# EAGLE design proyek kelompok 10 (EAGLE 7.2.0)
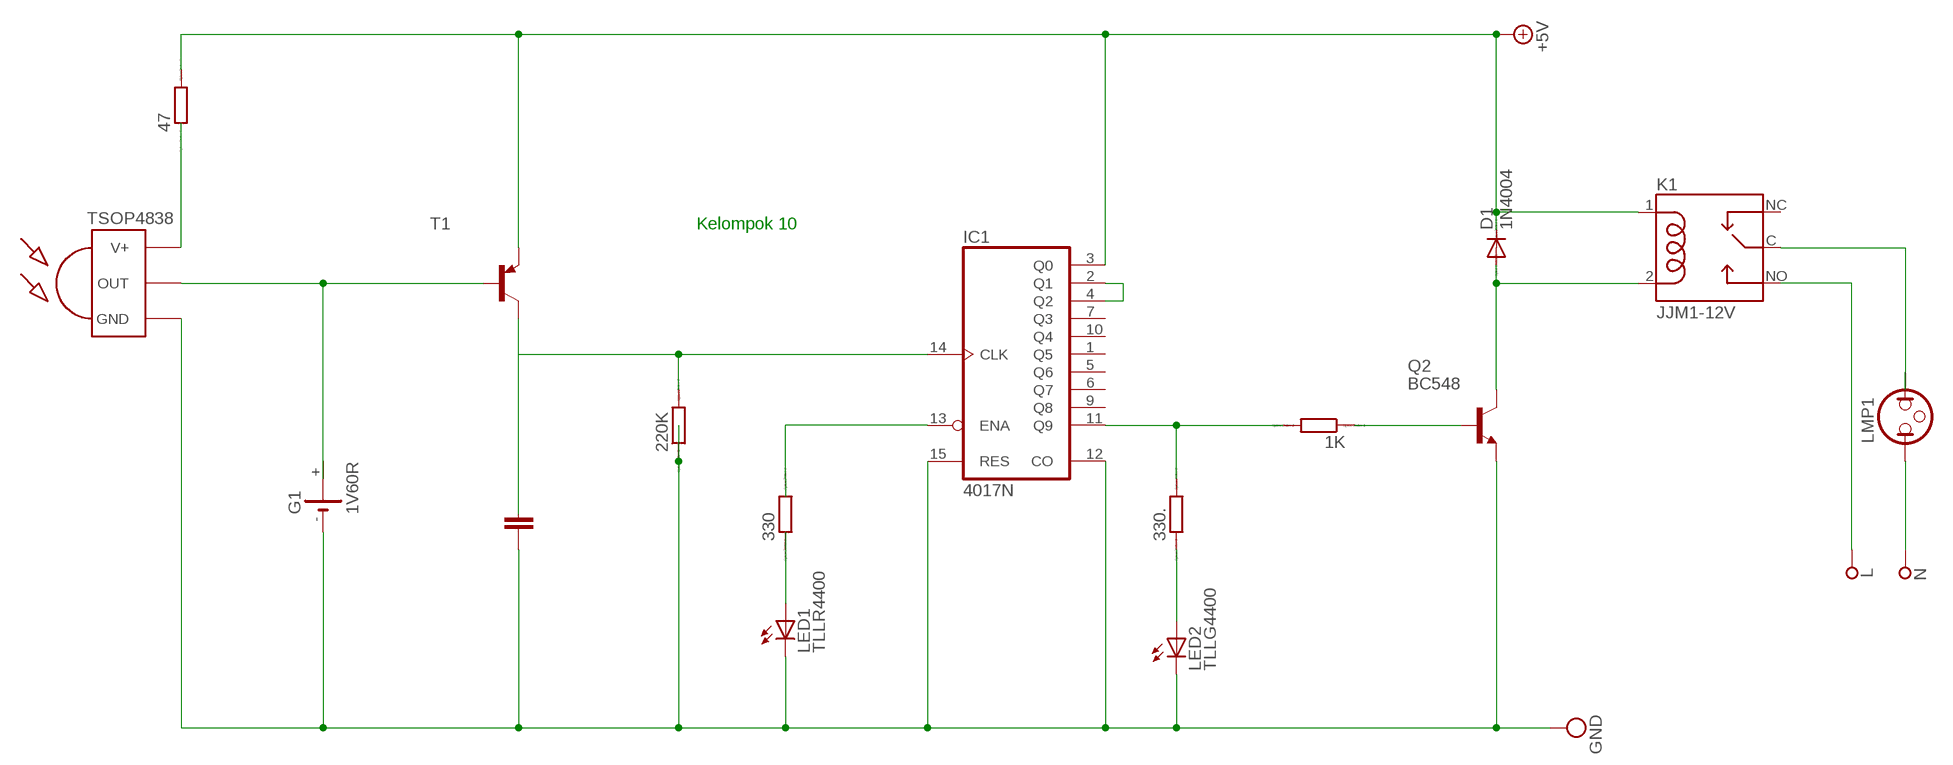
[diagram p0: schematic, sheet 1]

## Parts
1K  R0207/10  [0207/10]
47  R0207/10  [0207/10]
220K  R0207/10  [0207/10]
330  R0207/10  [0207/10]
330.  R0207/10  [0207/10]
D1  1N4004  [DO41-10]
G1  1V60R  [1V60R]
IC1  4017N  [DIL16]
K1  JJM1-12V  [RELAY_JJM1-12V]
L  SPECIAL_DRILL_0.1000  [PAD_0.1000]
LED1  TLLR4400  [LED3MM]
LED2  TLLG4400  [LED3MM]
LMP1  NEON  [LDH-3R]
N  SPECIAL_DRILL_0.1000  [PAD_0.1000]
Q2  BC548  [TO92-EBC]
T1  BC558A-PNP-TO92-EBC  [TO92-EBC]
U$1  TSOP4838  [TSOP18XX]

## Nets
47: 47.1 U$1.VCC(V+)
+5V: 47.2 D1.C IC1.3(Q0) K1.1(C1) T1.E
N$2: G1.+@1(+) T1.B U$1.OUT
N$3: 220K.2 IC1.14(CLK)
N$4: T1.C
N$5: K1.C(M) LMP1.2
N$6: 330.1 LED1.A
N$7: 1K.2 330..2 IC1.11(Q9)
N$8: 330.2 IC1.13(ENA)
N$9: D1.A K1.2(C2) Q2.C
N$11: LMP1.1 N.1
N$12: K1.NO L.1
N$14: IC1.2(Q1) IC1.4(Q2)
N$16: 1K.1 Q2.B
N$17: 330..1 LED2.A
VDD: 220K.1 G1.- IC1.12(CO) IC1.15(RES) LED1.K(C) LED2.K(C) Q2.E U$1.GND ; supply symbol labelled GND
Unconnected: G1.+ IC1.1(Q5) IC1.5(Q6) IC1.6(Q7) IC1.7(Q3) IC1.9(Q8) IC1.10(Q4) K1.NC

## Notes on the sheet
- Kelompok 10

## Power pins joined to a net without a drawn wire
VDD: IC1.16(VDD)
VSS: IC1.8(VSS)

## Library data of the parts
1K 47 220K 330 330. = eagle-ltspice:R: RESISTOR, European symbol; SPICEMODEL: NONE; SPICEPREFIX: R
D1 = diode:1N4004: DIODE general purpose rectifier, 1 A
G1 = battery:1V60R: NC ACCU Varta
IC1 = 40xx:4017: COUNTER/DIVIDER
K1 = JJM1-12V:JJM1-12V: Electromechanical Relay 12VDC 225Ohm 20(NO)/10(NC)A SPDT (( 15.5mm 12mm 13.9mm)) THT Automotive Relay Check availability <https://pricing.snapeda.com/parts/JJM1-12V/Panasonic%20Electric%20Works/view-part?ref=eda>; AVAILABILITY: In Stock; DESCRIPTION: RELAY AUTOMOTIVE SPDT 20A 12V; MF: Panasonic Electric Works; MP: JJM1-12V; PACKAGE: None; PRICE: None; PURCHASE-URL: https://pricing.snapeda.com/search/part/JJM1-12V/?ref=eda
L N = special-drill:SPECIAL_DRILL_: Special drills
LED1 = led:TLLR4400: Low Current (2mA) LED 3 mm Tinted Diffused Package color RED Source: Data sheet <http://www.farnell.com/datasheets/391100.pdf>; MF: VISHAY SEMICONDUCTOR; OC_FARNELL: 1612437
LED2 = led:TLLG4400: Low Current (2mA) LED 3 mm Tinted Diffused Package color GREEN Source: Data sheet <http://www.farnell.com/datasheets/391098.pdf>; MF: VISHAY SEMICONDUCTOR; OC_FARNELL: 1612435
LMP1 = special:NEON: Neon LAMP
Q2 = transistor-npn:BC548*: NPN Transistor
T1 = transistor:*-PNP-: PNP Transistror
U$1 = tsop-1:TSOP4838: IR Receiver and Demodulator

## Board
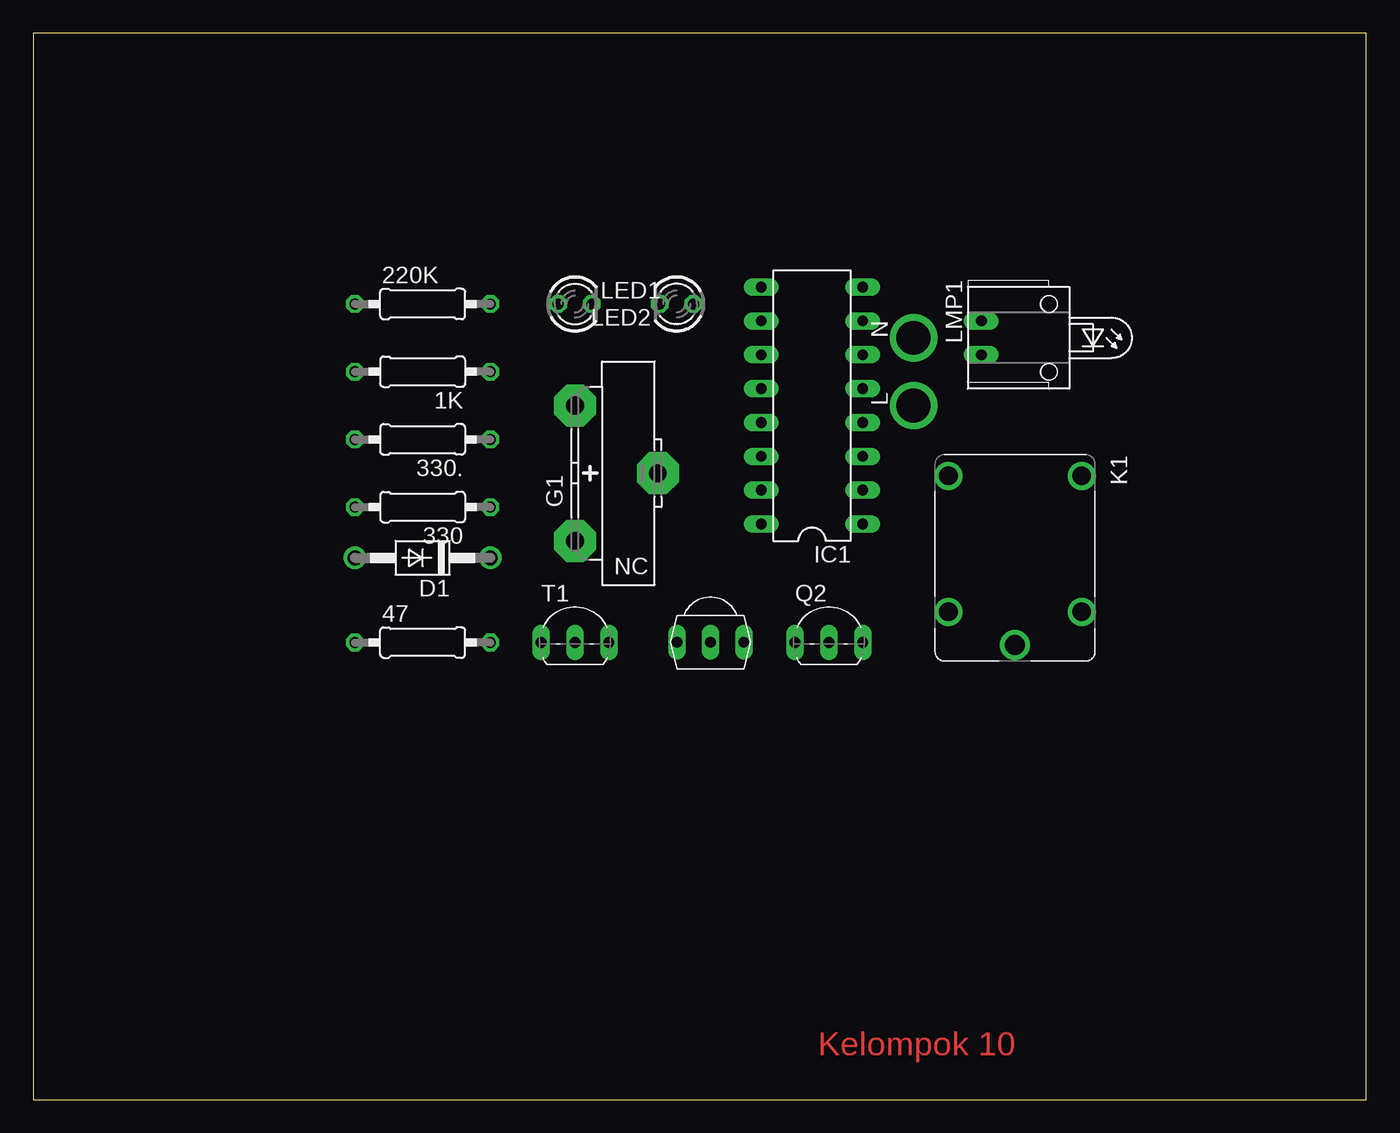
[diagram p1: board, top side]
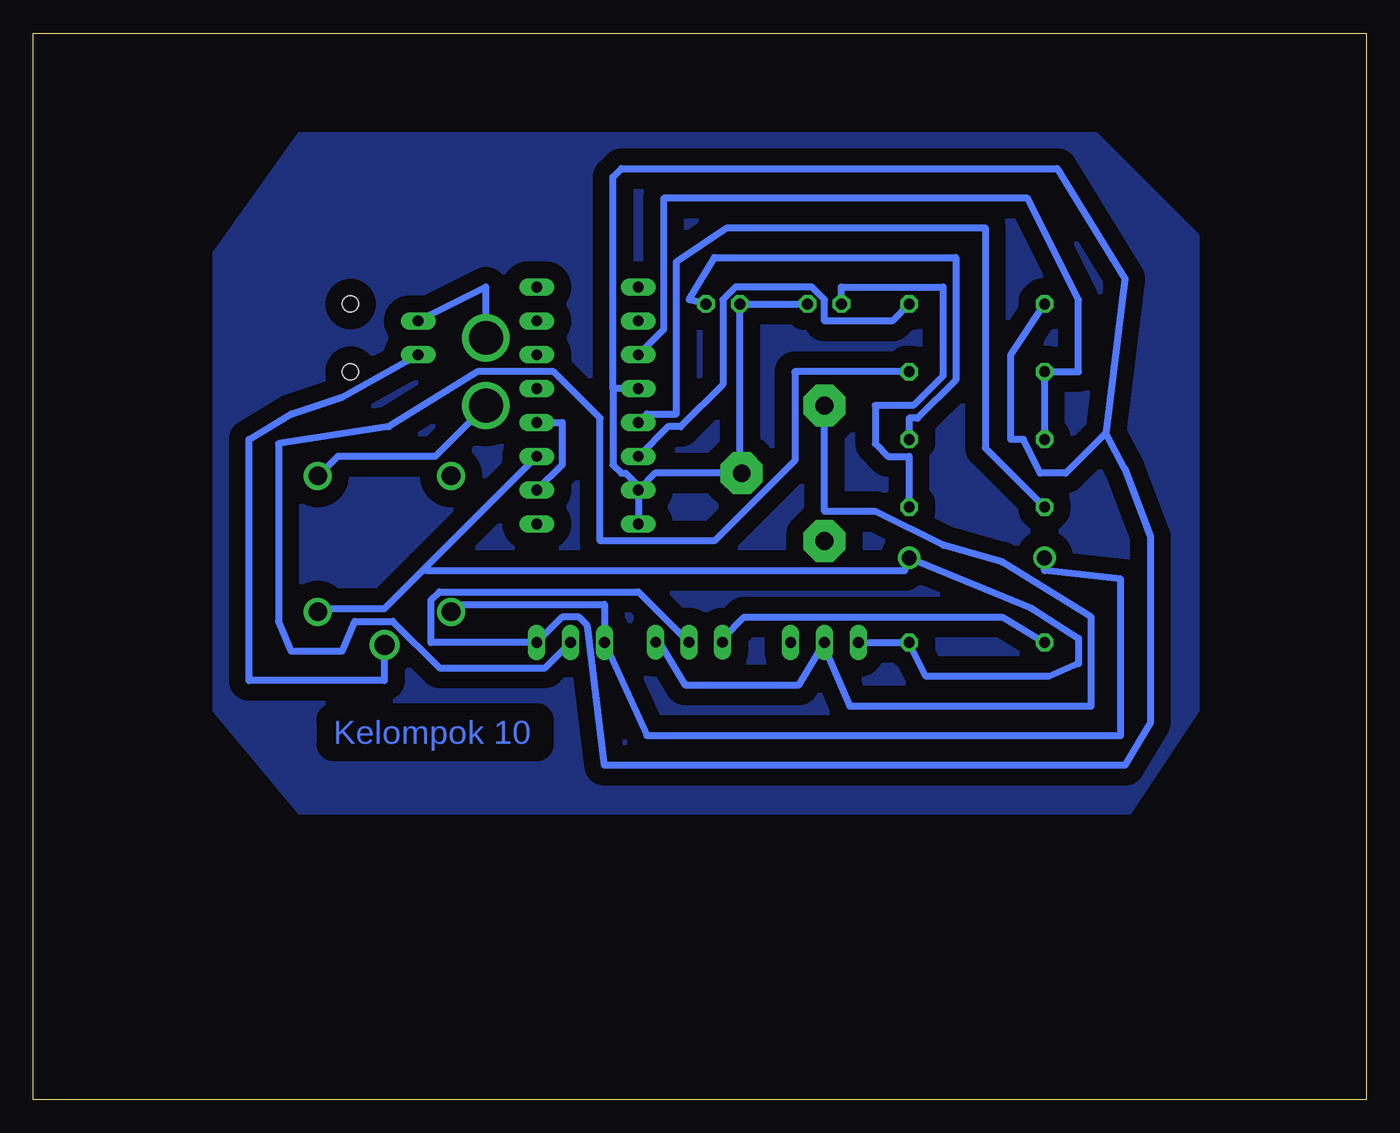
[diagram p2: board, bottom side, seen from below]

Size 100 x 80 mm. Coordinates in mm from the lower left corner, seen from the top.
Outline: 0,0 100,0 100,80 0,80 0,0
Copper layers (1*16): Top 0.035mm / dielectric 1.5mm / Bottom 0.035mm
Design rules "default *": minimum track width 20mil, minimum drill 24mil, track to track 8mil, track to pad 8mil, pad to pad 8mil, via to via 8mil, smd to smd 8mil, copper to edge 40mil, drill to drill 8mil, minimum pad ring 10mil, minimum via ring 8mil, stop-mask expansion 4mil, vias tented up to drill 0mil, thermal gap 10mil

### Footprints (pad centres in the part's own frame; a part is rotated, then mirrored left to right if it is on the bottom)
0207/10 = drill 0.813 octagon: 1 -5.08,0; 2 5.08,0
DO41-10 = drill 1.118: A 5.08,0; C -5.08,0
1V60R = drill 1.321 pad 3.15 octagon: + -2.54,-5.08; +@1 -2.54,5.08; - 3.683,0
DIL16 = drill 0.813 long: 1 -8.89,-3.81; 2 -6.35,-3.81; 3 -3.81,-3.81; 4 -1.27,-3.81; 5 1.27,-3.81; 6 3.81,-3.81; 7 6.35,-3.81; 8 8.89,-3.81; 9 8.89,3.81; 10 6.35,3.81; 11 3.81,3.81; 12 1.27,3.81; 13 -1.27,3.81; 14 -3.81,3.81; 15 -6.35,3.81; 16 -8.89,3.81
RELAY_JJM1-12V = drill 1.4: 1 4.05,5; 2 4.05,-5; NC -6.15,-5; NO -6.15,5 | drill 1.5: C 6.55,0
PAD_0.1000 = drill 2.54 pad 2.54: 1 0,0
LED3MM = drill 0.813 octagon: A -1.27,0; K 1.27,0
LDH-3R = drill 0.813 long: 1 -1.27,-5.08; 2 1.27,-5.08 | hole 1.219: 2.54,0; -2.54,0
TO92-EBC = drill 0.813 long: B 0,-1.27; C -2.54,-1.27; E 2.54,-1.27
TO92-EBC' = drill 0.813 long: B 0,-1.27; C 2.54,-1.27; E -2.54,-1.27
TSOP18XX = drill 0.813 long: GND -0.001,-0.027; OUT -2.501,-0.027; VCC 2.499,-0.027

### Placement (x,y rotation side)
1K  29.21,54.61 180 top
47  29.21,34.29 0 top
220K  29.21,59.69 0 top
330  29.21,44.45 180 top
330.  29.21,49.53 180 top
D1  29.21,40.64 180 top
G1  43.18,46.99 0 top
IC1  58.42,52.07 90 top
K1  73.66,40.64 270 top
L  66.04,52.07 90 top
LED1  40.64,59.69 0 top
LED2  48.26,59.69 180 top
LMP1  76.2,57.15 270 top
N  66.04,57.15 90 top
Q2  59.69,35.56 0 top
T1  [TO92-EBC']  40.64,35.56 0 top
U$1  50.8,34.29 180 top

### Tracks (layer width: path | path; a pad name or v marks a point on that pad's centre or on a via)
47
  Bottom 0.508: 47.1 27.3,36.2 46.67,36.2 48.26,34.61 U$1.VCC
+5V
  Bottom 0.508: T1.E 47.2 33.02,31.75 23.81,31.75 21.59,32.7 21.59,34.61 25.08,36.83 D1.C 34.61,39.69 70.48,39.69 70.64,39.85 | 70.64,39.85 73.66,36.83 78.42,36.83 K1.1 | 70.64,39.85 IC1.3
N$1
  pour Bottom (isolate 1.27): 20.32,72.39 12.7,64.77 12.7,29.21 17.78,21.59 80.01,21.59 86.36,29.21 86.36,63.5 80.01,72.39
N$2
  Bottom 0.508: U$1.OUT 53.02,34.29 51.12,31.11 42.55,31.11 T1.B 40.64,33.97 38.73,29.53 20.64,29.53 20.64,36.2 27.3,40.32 31.75,41.59 36.83,44.13 40.64,44.13 G1.+@1
N$3
  Bottom 0.508: IC1.14 52.39,50.48 51.44,50.48 48.26,53.66 48.26,60.01 47.31,60.96 41.59,60.96 40.64,60.01 40.64,58.42 35.56,58.42 220K.2
N$5
  Bottom 0.508: LMP1.2 76.83,52.7 80.64,51.44 83.82,49.53 83.82,31.43 73.66,31.43 K1.C
N$6
  Bottom 0.508: 330.1 34.29,48.26 35.88,48.26 36.83,49.21 36.83,52.07 33.97,52.07 31.75,54.29 31.75,60.96 39.37,60.96 LED1.A
N$7
  Bottom 0.508: 330..2 1K.2 21.59,54.61 21.59,60.01 25.4,67.63 52.7,67.63 52.7,57.78 IC1.11
N$8
  Bottom 0.508: 330.2 28.57,48.9 28.57,65.41 47.94,65.41 51.75,62.87 51.75,51.44 53.98,51.44 IC1.13
N$9
  Bottom 0.508: K1.2 68.58,36.83 68.26,37.15 57.15,37.15 Q2.C 53.98,27.3 18.41,27.3 18.41,39.05 24.13,39.69 D1.A
N$11
  Bottom 0.508: LMP1.1 66.04,60.96 N.1
N$12
  Bottom 0.508: L.1 69.85,48.26 77.15,48.26 78.42,46.99 K1.NO
N$14
  Bottom 0.508: IC1.2 60.33,47.62 60.33,50.8 IC1.4
N$16
  Bottom 0.508: Q2.B 61.59,32.38 69.53,32.38 73.03,35.88 75.88,35.88 76.83,33.66 80.64,33.66 81.6,35.88 81.6,49.21 73.34,50.48 66.67,54.61 60.96,54.61 57.47,51.12 57.47,41.91 48.9,41.91 42.86,47.94 42.86,54.61 1K.1
N$17
  Bottom 0.508: 330..1 34.29,51.12 33.66,51.12 30.8,53.98 30.8,63.18 48.9,63.18 50.8,60.01 LED2.A
VDD
  Bottom 0.508: LED1.K LED2.K 46.99,46.99 | IC1.15 IC1.16 | IC1.15 53.34,46.99 46.99,46.99 | 46.99,46.99 G1.- | U$1.GND 51.12,34.61 54.61,38.1 69.53,38.1 70.17,37.47 70.17,34.29 Q2.E 60.33,36.2 59.05,36.2 58.42,35.56 57.15,25.08 18.1,25.08 16.19,28.26 16.19,42.23 18.1,47.31 19.53,50.01 | 220K.1 26.67,55.88 26.67,49.53 25.72,49.53 24.45,46.99 22.54,46.99 19.53,50.01 | 56.52,53.34 56.52,69.22 55.88,69.85 23.18,69.85 18.1,61.59 19.53,50.01 | IC1.12 56.52,53.34 | 56.52,53.34 56.52,47.62 55.88,46.99 55.56,46.99 54.61,46.04 IC1.15

### Text on the board
Top: Kelompok 10
Bottom: Kelompok 10